# EAGLE design motor ic (EAGLE 6.1)
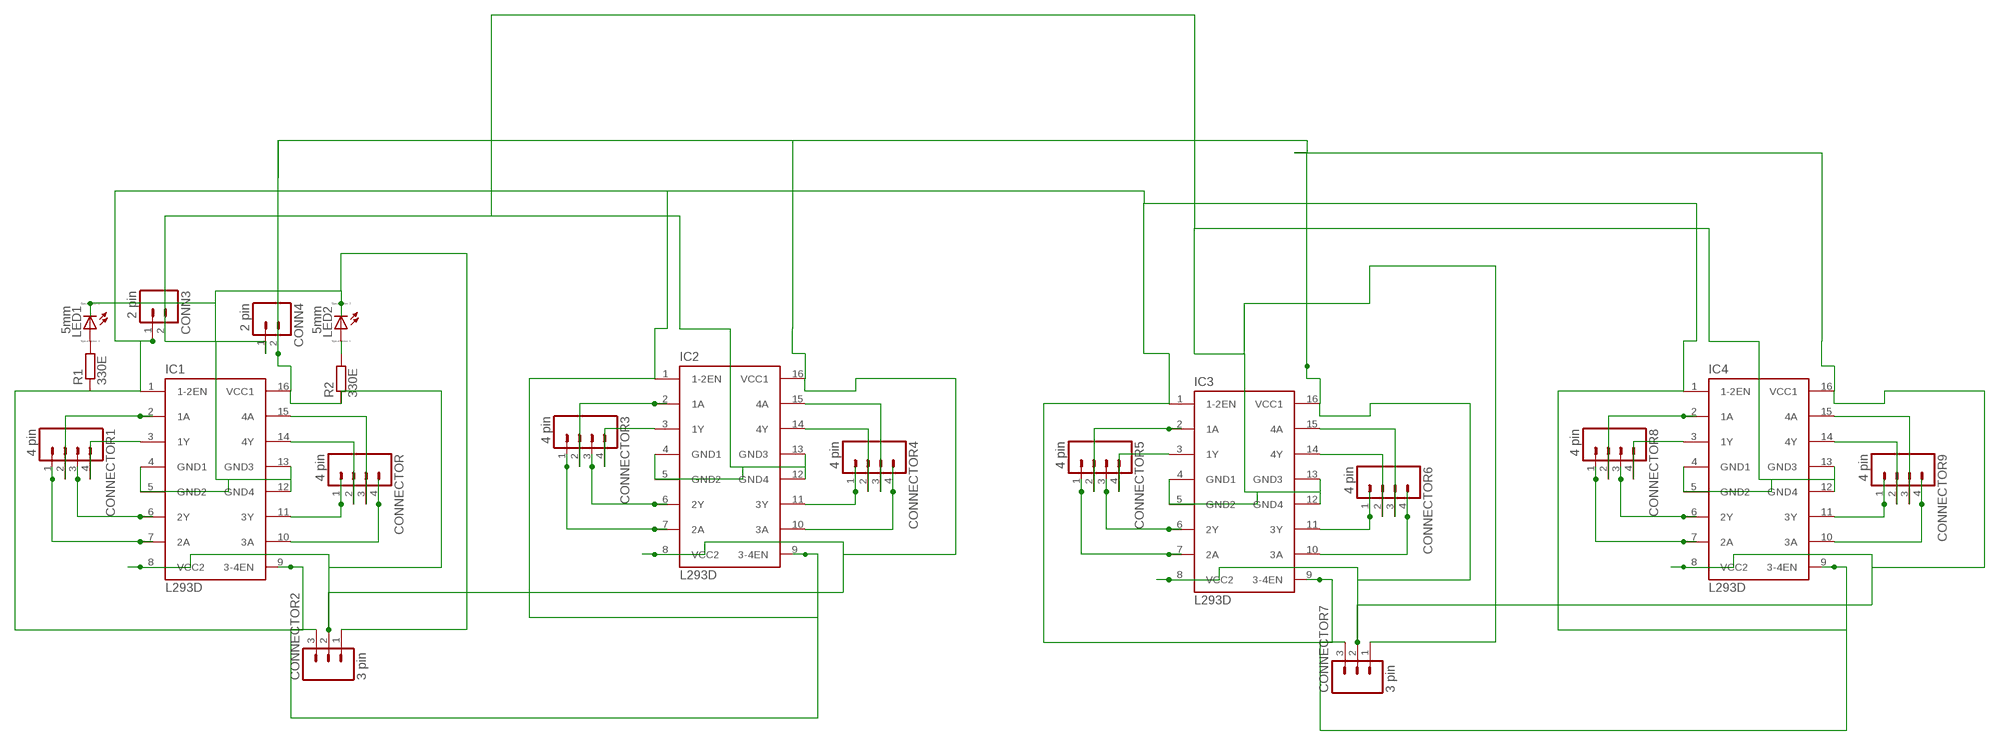
[diagram p0: schematic, sheet 1]

## Parts
CONN3  2 pin  M02  [02P]
CONN4  2 pin  M02  [02P]
CONNECTOR  4 pin  M04  [04P]
CONNECTOR1  4 pin  M04  [04P]
CONNECTOR2  3 pin  M03  [03P]
CONNECTOR3  4 pin  M04  [04P]
CONNECTOR4  4 pin  M04  [04P]
CONNECTOR5  4 pin  M04  [04P]
CONNECTOR6  4 pin  M04  [04P]
CONNECTOR7  3 pin  M03  [03P]
CONNECTOR8  4 pin  M04  [04P]
CONNECTOR9  4 pin  M04  [04P]
IC1  L293D  [DIL16]
IC2  L293D  [DIL16]
IC3  L293D  [DIL16]
IC4  L293D  [DIL16]
LED1  5mm  LED_ELD260  [LED_LD260]
LED2  5mm  LED_ELD260  [LED_LD260]
R1  330E  R-EU_0204/7  [0204/7]
R2  330E  R-EU_0204/7  [0204/7]

## Nets
N$1: LED1.A R1.2
N$2: LED2.A R2.2
N$4: CONNECTOR1.2 IC1.2(1A)
N$5: CONNECTOR1.4 IC1.3(1Y)
N$6: CONNECTOR1.3 IC1.6(2Y)
N$7: CONNECTOR1.1 IC1.7(2A)
N$8: CONNECTOR.3 IC1.15(4A)
N$9: CONNECTOR.4 IC1.10(3A)
N$10: CONNECTOR.2 IC1.14(4Y)
N$11: CONNECTOR.1 IC1.11(3Y)
N$12: CONN3.2 CONN4.1 CONNECTOR2.1 CONNECTOR7.1 IC1.4(GND1) IC1.5(GND2) IC1.12(GND4) IC1.13(GND3) IC2.4(GND1) IC2.5(GND2) IC2.12(GND4) IC2.13(GND3) IC3.4(GND1) IC3.5(GND2) IC3.12(GND4) IC3.13(GND3) IC4.4(GND1) IC4.5(GND2) IC4.12(GND4) IC4.13(GND3) LED1.K(C) LED2.K(C)
N$13: CONN3.1 CONNECTOR2.3 CONNECTOR7.3 IC1.1(1-2EN) IC1.9(3-4EN) IC2.1(1-2EN) IC2.9(3-4EN) IC3.1(1-2EN) IC3.9(3-4EN) IC4.1(1-2EN) IC4.9(3-4EN) R1.1
N$14: CONN4.2 CONNECTOR2.2 CONNECTOR7.2 IC1.8(VCC2) IC1.16(VCC1) IC2.8(VCC2) IC2.16(VCC1) IC3.8(VCC2) IC3.16(VCC1) IC4.8(VCC2) IC4.16(VCC1) R2.1
N$16: CONNECTOR3.2 IC2.2(1A)
N$17: CONNECTOR3.4 IC2.3(1Y)
N$18: CONNECTOR3.3 IC2.6(2Y)
N$19: CONNECTOR3.1 IC2.7(2A)
N$20: CONNECTOR4.3 IC2.15(4A)
N$21: CONNECTOR4.4 IC2.10(3A)
N$22: CONNECTOR4.2 IC2.14(4Y)
N$23: CONNECTOR4.1 IC2.11(3Y)
N$24: CONNECTOR5.2 IC3.2(1A)
N$25: CONNECTOR5.4 IC3.3(1Y)
N$26: CONNECTOR5.3 IC3.6(2Y)
N$27: CONNECTOR5.1 IC3.7(2A)
N$28: CONNECTOR6.3 IC3.15(4A)
N$29: CONNECTOR6.4 IC3.10(3A)
N$30: CONNECTOR6.2 IC3.14(4Y)
N$31: CONNECTOR6.1 IC3.11(3Y)
N$35: CONNECTOR8.2 IC4.2(1A)
N$36: CONNECTOR8.4 IC4.3(1Y)
N$37: CONNECTOR8.3 IC4.6(2Y)
N$38: CONNECTOR8.1 IC4.7(2A)
N$39: CONNECTOR9.3 IC4.15(4A)
N$40: CONNECTOR9.4 IC4.10(3A)
N$41: CONNECTOR9.2 IC4.14(4Y)
N$42: CONNECTOR9.1 IC4.11(3Y)

## Library data of the parts
CONN3 CONN4 = con-amp-quick:M02: AMP QUICK CONNECTOR; OC_FARNELL: unknown; OC_NEWARK: unknown
CONNECTOR CONNECTOR1 CONNECTOR3-CONNECTOR6 CONNECTOR8 CONNECTOR9 = con-amp-quick:M04: AMP QUICK CONNECTOR; OC_FARNELL: unknown; OC_NEWARK: unknown
CONNECTOR2 CONNECTOR7 = con-amp-quick:M03: AMP QUICK CONNECTOR; OC_FARNELL: unknown; OC_NEWARK: unknown
IC1-IC4 = st-microelectronics:L293D: PUSH-PULL 4 CHANNEL DRIVER; MPN: L293D; OC_FARNELL: 9589619; OC_NEWARK: 56P8249
LED1 LED2 = eagle-ltspice:LED_E: LED Source: http://www.osram.convergy.de Source: www.luxeon.com Source: www.kingbright.com; SPICEMODEL: NONE; SPICEPREFIX: D; SPICETYPE: diode
R1 R2 = rcl:R-EU_: RESISTOR, European symbol

## Board
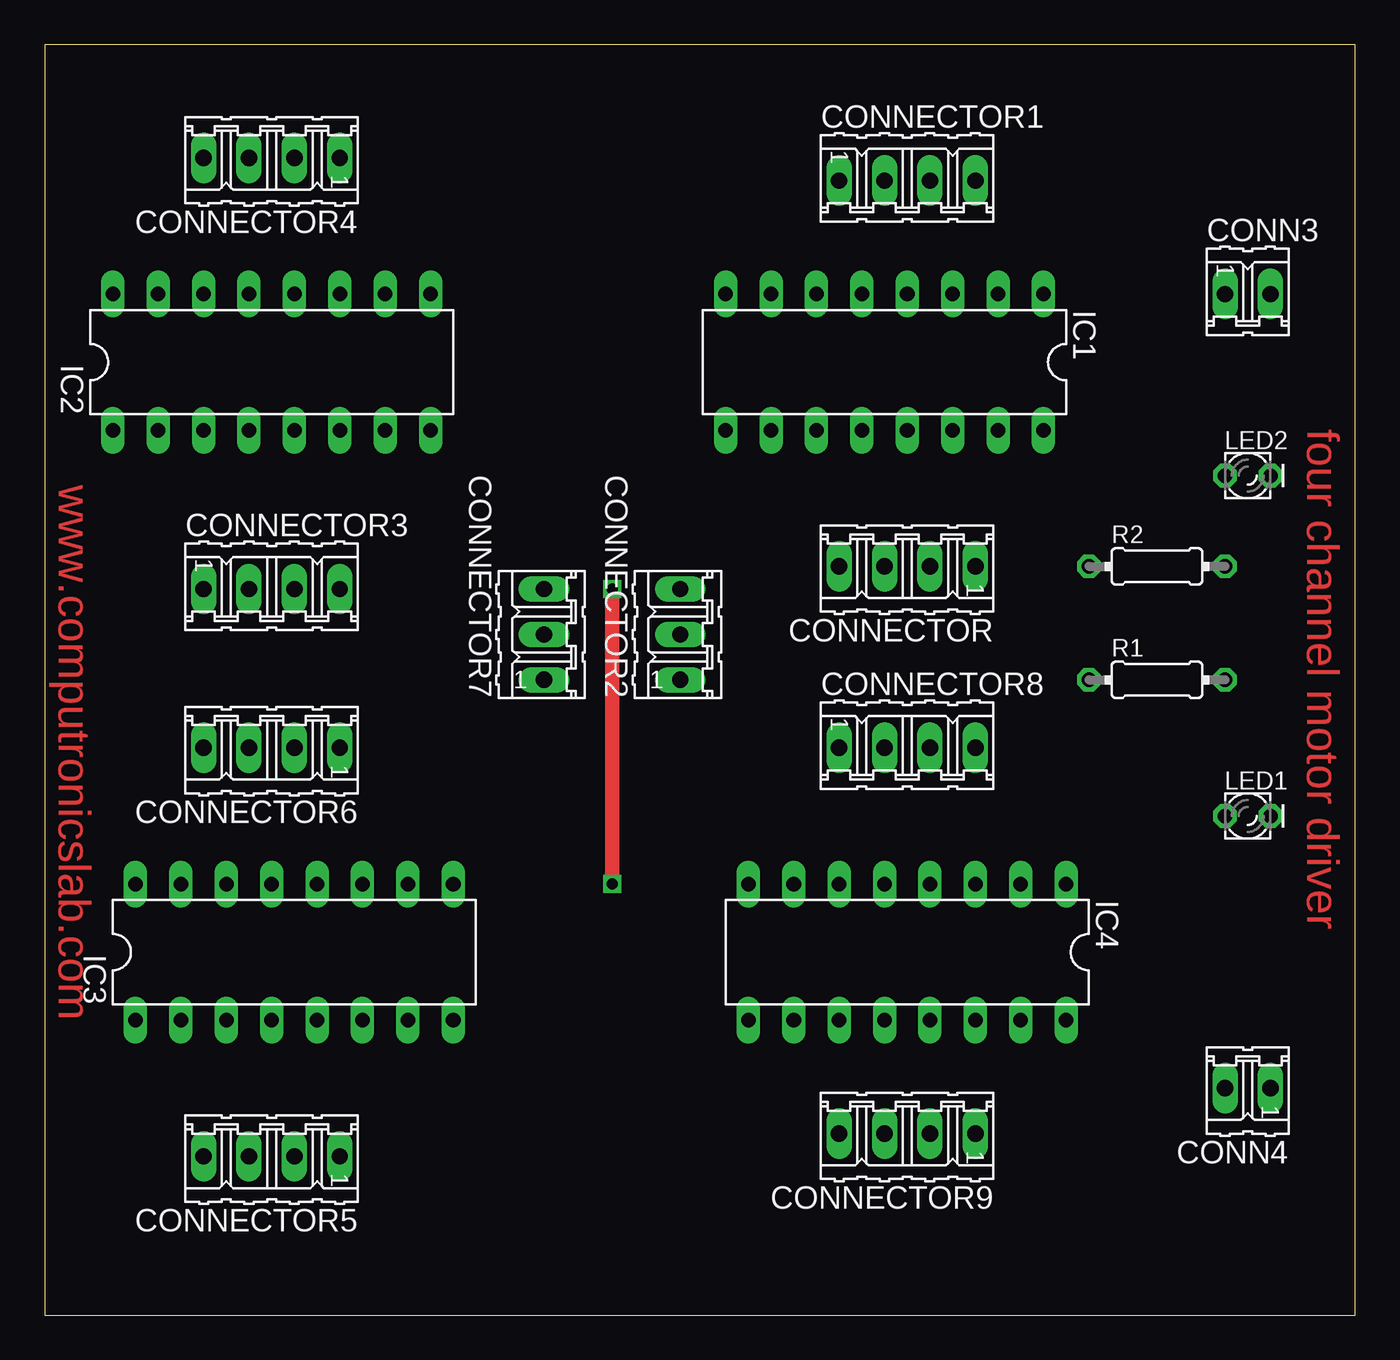
[diagram p1: board, top side]
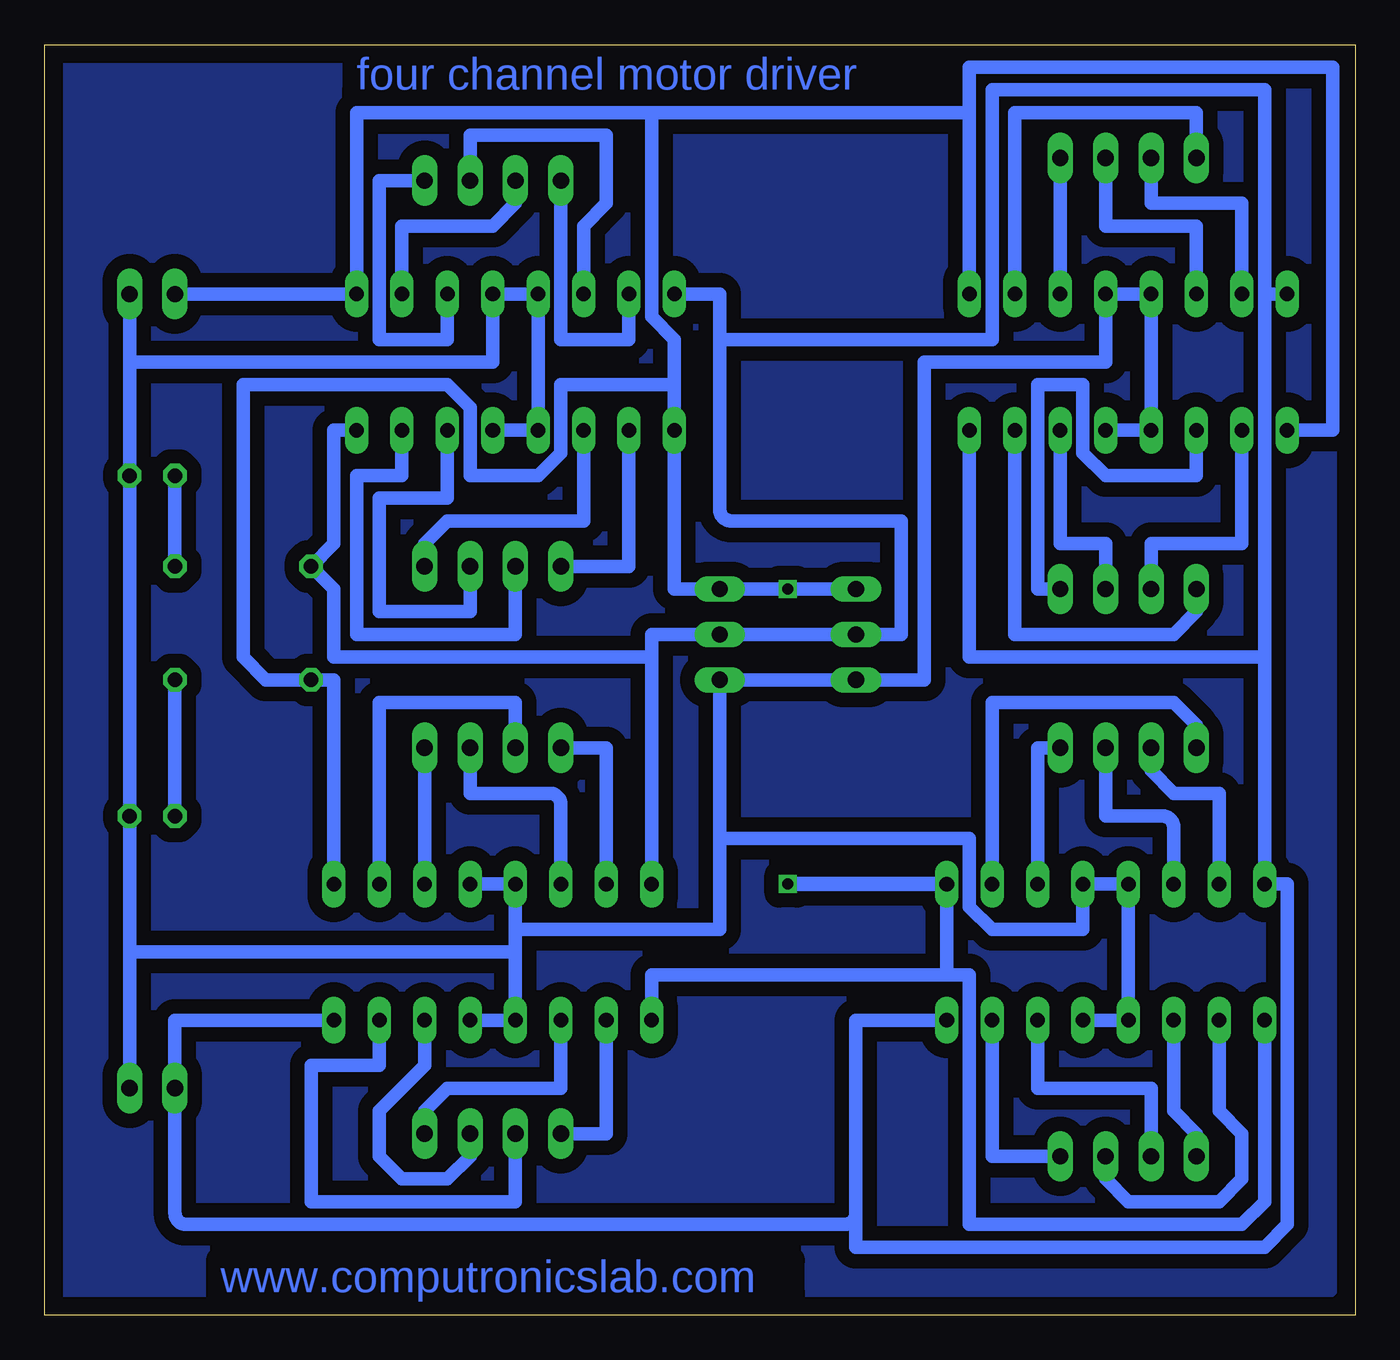
[diagram p2: board, bottom side, seen from below]

Size 73.33 x 71.11 mm. Coordinates in mm from the lower left corner, seen from the top.
Outline: 0,0 73.33,0 73.33,71.11 0,71.11 0,0
Copper layers (1*16): Top 0.035mm / dielectric 1.5mm / Bottom 0.035mm
Design rules: minimum track width 30mil, minimum drill 24mil, track to track 8mil, track to pad 8mil, pad to pad 8mil, via to via 8mil, smd to smd 8mil, copper to edge 40mil, drill to drill 8mil, minimum pad ring 10mil, minimum via ring 8mil, stop-mask expansion 4mil, vias tented up to drill 0mil, thermal gap 10mil

### Footprints (pad centres in the part's own frame; a part is rotated, then mirrored left to right if it is on the bottom)
02P = drill 0.914 long: 1 -1.27,0; 2 1.27,0
04P = drill 0.914 long: 1 -3.81,0; 2 -1.27,0; 3 1.27,0; 4 3.81,0
03P = drill 0.914 long: 1 -2.54,0; 2 0,0; 3 2.54,0
DIL16 = drill 0.813 long: 1 -8.89,-3.81; 2 -6.35,-3.81; 3 -3.81,-3.81; 4 -1.27,-3.81; 5 1.27,-3.81; 6 3.81,-3.81; 7 6.35,-3.81; 8 8.89,-3.81; 9 8.89,3.81; 10 6.35,3.81; 11 3.81,3.81; 12 1.27,3.81; 13 -1.27,3.81; 14 -3.81,3.81; 15 -6.35,3.81; 16 -8.89,3.81
LED_LD260 = drill 0.813 octagon: A -1.27,0; K 1.27,0
0204/7 = drill 0.813 octagon: 1 -3.81,0; 2 3.81,0

### Placement (x,y rotation side)
CONN3  67.31,57.15 0 top
CONN4  67.31,12.7 180 top
CONNECTOR  48.26,41.91 180 top
CONNECTOR1  48.26,63.5 0 top
CONNECTOR2  35.56,38.1 90 top
CONNECTOR3  12.7,40.64 0 top
CONNECTOR4  12.7,64.77 180 top
CONNECTOR5  12.7,8.89 180 top
CONNECTOR6  12.7,31.75 180 top
CONNECTOR7  27.94,38.1 90 top
CONNECTOR8  48.26,31.75 0 top
CONNECTOR9  48.26,10.16 180 top
IC1  46.99,53.34 180 top
IC2  12.7,53.34 0 top
IC3  13.97,20.32 0 top
IC4  48.26,20.32 180 top
LED1  67.31,27.94 0 top
LED2  67.31,46.99 0 top
R1  62.23,35.56 0 top
R2  62.23,41.91 0 top

### Tracks (layer width: path | path; a pad name or v marks a point on that pad's centre or on a via)
N$1
  Bottom 0.762: R1.2 LED1.A
N$2
  Bottom 0.762: LED2.A R2.2
N$3
  pour Bottom (isolate 0.813): 6.35,0 2.8,0 arc-45 2.35,0.19 0,2.54 0,69.59 arc-45 0.19,70.04 1.27,71.12 70.86,71.12 arc-45 71.31,70.93 73.66,68.58 73.66,2.8 arc-45 73.47,2.35 71.12,0
N$4
  Bottom 0.762: IC1.2 53.34,60.96 48.26,60.96 46.99,62.23 CONNECTOR1.2
N$5
  Bottom 0.762: IC1.3 50.8,54.61 54.61,54.61 54.61,63.5 CONNECTOR1.4
N$6
  Bottom 0.762: IC1.6 43.18,60.96 41.91,62.23 41.91,66.04 48.26,66.04 49.53,66.04 49.53,64.77 CONNECTOR1.3
N$7
  Bottom 0.762: IC1.7 40.64,54.61 44.45,54.61 CONNECTOR1.1
N$8
  Bottom 0.762: IC1.15 53.34,46.99 55.88,46.99 55.88,44.45 55.88,38.1 49.53,38.1 46.99,38.1 46.99,40.64 CONNECTOR.3
N$9
  Bottom 0.762: IC1.10 40.64,41.91 CONNECTOR.4
N$10
  Bottom 0.762: IC1.14 50.8,45.72 52.07,45.72 54.61,45.72 54.61,43.18 54.61,39.37 50.8,39.37 49.53,39.37 49.53,40.64 CONNECTOR.2
N$11
  Bottom 0.762: IC1.11 43.18,44.45 50.8,44.45 52.07,43.18 CONNECTOR.1
N$12
  Bottom 0.762: CONN4.1 68.58,20.32 | 68.58,20.32 LED1.K LED2.K 68.58,53.34 | IC1.13 IC1.12 IC1.5 IC1.4 48.26,53.34 68.58,53.34 | CONN3.2 68.58,53.34 | IC2.5 IC2.4 IC2.13 IC2.12 13.97,53.34 19.05,53.34 20.32,53.34 22.86,53.34 24.13,53.34 24.13,49.53 24.13,35.56 CONNECTOR7.1 CONNECTOR2.1 35.56,26.67 | IC3.5 IC3.4 IC3.13 IC3.12 15.24,21.59 20.32,21.59 21.59,22.86 21.59,26.67 35.56,26.67 | IC4.13 IC4.12 46.99,20.32 | IC4.4 IC4.5 46.99,21.59 | 46.99,21.59 46.99,20.32 | 35.56,26.67 35.56,21.59 46.99,21.59 | 46.99,20.32 68.58,20.32
N$13  (via drill 0.6)
  Top 0.813: v31.75,24.13 v31.75,40.64
  Bottom 0.762: IC4.1 57.15,35.56 R1.1 60.96,35.56 62.23,36.83 62.23,52.07 50.8,52.07 49.53,50.8 49.53,46.99 45.72,46.99 44.45,48.26 44.45,52.07 40.64,52.07 38.1,52.07 IC1.9 | IC1.9 38.1,40.64 CONNECTOR2.3 v31.75,40.64 CONNECTOR7.3 | CONN3.1 IC1.1 55.88,67.31 39.37,67.31 | IC2.1 1.27,49.53 1.27,57.15 1.27,69.85 21.59,69.85 21.59,67.31 | IC2.9 21.59,67.31 | 21.59,67.31 39.37,67.31 | IC1.9 38.1,54.61 39.37,55.88 39.37,67.31 | IC3.1 5.08,6.35 6.35,5.08 19.05,5.08 21.59,5.08 21.59,7.62 21.59,19.05 22.86,19.05 | 22.86,19.05 39.37,19.05 IC4.9 | 22.86,19.05 IC3.9
  Bottom 0.813: IC3.9 v31.75,24.13
N$14
  Bottom 0.762: 27.94,11.43 27.94,6.35 27.94,5.71 arc90 28.58,5.08 34.29,5.08 58.42,5.08 65.41,5.08 arc90 66.04,5.71 66.04,10.16 66.04,16.51 | 27.94,11.43 27.94,16.51 IC3.8 | CONN4.2 66.04,16.51 | 66.04,16.51 IC4.16 | 5.08,57.15 5.08,36.83 | 5.08,36.83 IC3.16 3.81,24.13 3.81,5.08 5.08,3.81 20.32,3.81 27.94,3.81 27.94,11.43 | IC2.16 5.08,57.15 | IC2.8 21.59,36.83 5.08,36.83 | 35.56,54.61 35.56,46.99 35.56,45.09 arc-90 34.93,44.45 25.4,44.45 25.4,38.1 CONNECTOR7.2 CONNECTOR2.2 39.37,38.1 39.37,36.83 | 35.56,54.61 35.56,57.15 IC1.8 | IC1.16 57.15,49.53 57.15,43.18 R2.1 57.15,40.64 57.15,36.83 39.37,36.83 | 39.37,36.83 IC4.8 | 5.08,57.15 5.08,68.58 20.32,68.58 20.32,54.61 35.56,54.61
N$16
  Bottom 0.762: IC2.2 6.35,43.18 11.43,43.18 11.43,41.91 CONNECTOR3.2
N$17
  Bottom 0.762: IC2.3 8.89,46.99 13.97,46.99 15.24,48.26 15.24,52.07 16.51,52.07 17.78,52.07 17.78,40.64 CONNECTOR3.4
N$18
  Bottom 0.762: IC2.6 16.51,43.18 13.97,43.18 13.97,41.91 CONNECTOR3.3
N$19
  Bottom 0.762: IC2.7 19.05,38.1 10.16,38.1 8.89,39.37 CONNECTOR3.1
N$20
  Bottom 0.762: IC2.15 6.35,62.23 10.16,62.23 11.43,62.23 11.43,63.5 CONNECTOR4.3
N$21
  Bottom 0.762: IC2.10 19.05,67.31 10.16,67.31 8.89,67.31 8.89,66.04 CONNECTOR4.4
N$22
  Bottom 0.762: IC2.14 8.89,60.96 11.43,60.96 13.97,60.96 13.97,63.5 CONNECTOR4.2
N$23
  Bottom 0.762: CONNECTOR4.1 IC2.11
N$24
  Bottom 0.762: IC3.2 7.62,11.43 6.35,10.16 6.35,7.62 7.62,6.35 12.7,6.35 13.97,7.62 CONNECTOR5.2
N$25
  Bottom 0.762: IC3.3 10.16,11.43 8.89,10.16 CONNECTOR5.4
N$26
  Bottom 0.762: IC3.6 17.78,12.7 11.43,12.7 11.43,10.16 CONNECTOR5.3
N$27
  Bottom 0.762: IC3.7 20.32,8.89 CONNECTOR5.1
N$28
  Bottom 0.762: IC3.15 7.62,29.21 10.16,29.21 11.43,30.48 CONNECTOR6.3
N$29
  Bottom 0.762: IC3.10 20.32,34.29 10.16,34.29 8.89,33.02 CONNECTOR6.4
N$30
  Bottom 0.762: IC3.14 10.16,26.67 10.16,27.3 arc-90 10.79,27.94 13.97,27.94 CONNECTOR6.2
N$31
  Bottom 0.762: IC3.11 17.78,31.75 CONNECTOR6.1
N$35
  Bottom 0.762: IC4.2 54.61,34.29 48.26,34.29 46.99,34.29 46.99,33.02 CONNECTOR8.2
N$36
  Bottom 0.762: CONNECTOR8.4 IC4.3
N$37
  Bottom 0.762: IC4.6 44.45,27.94 44.45,28.58 arc-90 45.09,29.21 49.53,29.21 CONNECTOR8.3
N$38
  Bottom 0.762: IC4.7 41.91,31.75 CONNECTOR8.1
N$39
  Bottom 0.762: IC4.15 54.61,13.97 58.42,13.97 58.42,6.35 46.99,6.35 46.99,8.89 CONNECTOR9.3
N$40
  Bottom 0.762: IC4.10 41.91,10.16 CONNECTOR9.4
N$41
  Bottom 0.762: IC4.14 52.07,13.97 54.61,11.43 54.61,8.89 53.34,7.62 50.8,7.62 49.53,8.89 CONNECTOR9.2
N$42
  Bottom 0.762: IC4.11 44.45,12.7 50.8,12.7 52.07,11.43 CONNECTOR9.1

### Text on the board
Top: four channel motor driver | www.computronicslab.com
Bottom: four channel motor driver | www.computronicslab.com